# Altium schematic sheet Sheet3.SchDoc
size A4; SheetNumber: 1; SheetTotal: 1
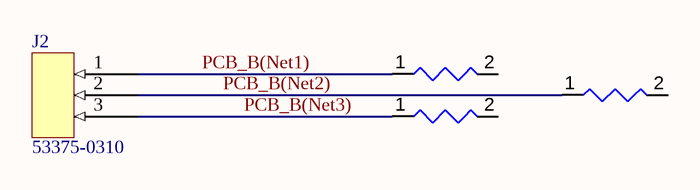
[diagram p0: Sheet3.SchDoc]

## Parts
J2  53375-0310  [SOJ127P870X356-20M]
R1  Resistor 10k +/-1% 1206 250 mW  [RESC3216X60X45ML15T20]  (value not drawn)
R2  Resistor 10k +/-1% 1206 250 mW  [RESC3216X60X45ML15T20]  (value not drawn)
R3  Resistor 10k +/-1% 1206 250 mW  [RESC3216X60X45ML15T20]  (value not drawn)

## Nets
PCB_B(Net1): J2.1 R1.1
PCB_B(Net2): J2.2 R2.1
PCB_B(Net3): J2.3 R3.1

Not connected (* = marked no-connect by the designer): R1 2; R2 2; R3 2

## Library data of the parts
J2 = CMP-002-00074-2: Board Connector, 3 Contact(s), 1 Row(s), Male, Straight, 0.098 inch Pitch, Solder Terminal, White Insulator, Receptacle; Manufacturer: Molex; Manufacturer Part Number: 53375-0310; System: Connector
R1-R3 = CMP-009-00016-5: Chip Resistor, 10 KOhm, +/- 1%, 0.25 W, -55 to 155 degC, 1206 (3216 Metric); Power: 250mW; Voltage Rating: 200V; Pins: 2; Max Operating Temperature: 155°C; Tolerance: 1%; Value: 10k; RoHS Compliant: True; Case/Package: 1206; Min Operating Temperature: -55°C; Mounting Technology: SM